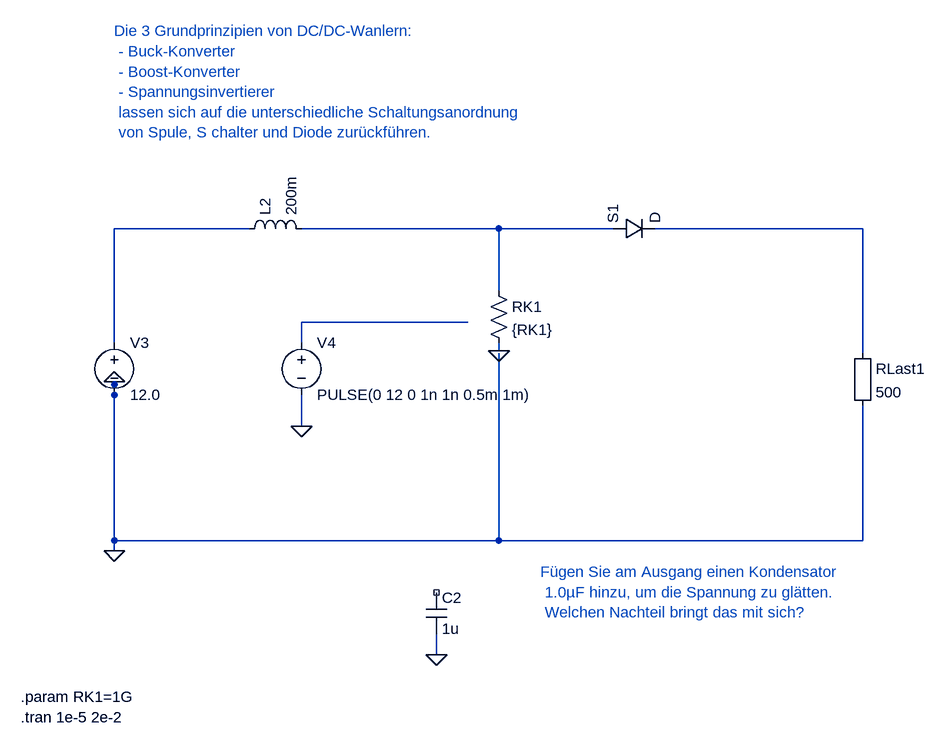
[diagram p0: schematic 2_1_2_Boost_Konverter.asc]
2_1_2_Boost_Konverter.asc, the LTspice schematic file:
Version 4
SHEET 1 880 680
WIRE 208 656 208 640
WIRE 1040 400 1072 400
WIRE 496 656 496 672
WIRE 704 1024 704 1040
WIRE 208 896 208 880
WIRE 208 880 208 640
WIRE 496 576 496 544
WIRE 496 544 752 544
WIRE 496 704 496 672
WIRE 800 496 800 400
WIRE 416 400 208 400
WIRE 208 400 208 576
WIRE 800 400 496 400
WIRE 976 400 800 400
WIRE 800 880 208 880
WIRE 800 592 800 880
WIRE 1072 400 1360 400
WIRE 1360 400 1360 592
WIRE 1360 672 1360 880
WIRE 1360 880 800 880
WIRE 704 1040 704 1056
WIRE 208 656 208 636
WIRE 800 576 800 588
FLAG 208 896 0
FLAG 496 704 0
FLAG 704 1056 0
FLAG 208 636 0
FLAG 496 704 0
FLAG 704 1056 0
FLAG 800 588 0
SYMBOL voltage 208 560 R0
SYMATTR InstName V3
SYMATTR Value 12.0
SYMBOL res 784 480 R0
SYMATTR InstName RK1
SYMATTR Value {RK1}
SYMBOL ind 400 416 R270
SYMATTR InstName L2
SYMATTR Value 200m
SYMBOL diode 976 416 R270
SYMATTR InstName S1
SYMATTR Value D
SYMBOL Misc\EuropeanResistor 1344 576 R0
SYMATTR InstName RLast1
SYMATTR Value 500
SYMBOL voltage 496 560 R0
SYMATTR InstName V4
SYMATTR Value PULSE(0 12 0 1n 1n 0.5m 1m)
SYMBOL cap 688 960 R0
SYMATTR InstName C2
SYMATTR Value 1u
TEXT 64 1120 Left 2 !.param RK1=1G
TEXT 64 1152 Left 2 !.tran 1e-5 2e-2
TEXT 208 96 Left 2 ;Die 3 Grundprinzipien von DC/DC-Wanlern: \n - Buck-Konverter \n - Boost-Konverter \n - Spannungsinvertierer \n lassen sich auf die unterschiedliche Schaltungsanordnung \n von Spule, S chalter und Diode zurückführen.
TEXT 864 928 Left 2 ;Fügen Sie am Ausgang einen Kondensator \n 1.0µF hinzu, um die Spannung zu glätten. \n Welchen Nachteil bringt das mit sich?

The netlist it stands for:
* 2_1_2_Boost_Konverter.asc
V3 N004 0 12.0
RK1 N003 0 {RK1}
L2 N004 N003 200m
D§S1 N003 N001 D
RLast1 N001 0 500
V4 N002 0 PULSE(0 12 0 1n 1n 0.5m 1m)
C2 NC_01 0 1u
.model D D
.lib standard.dio
.param RK1=1G
.tran 1e-5 2e-2
* Die 3 Grundprinzipien von DC/DC-Wanlern:
*  - Buck-Konverter
*  - Boost-Konverter
*  - Spannungsinvertierer
*  lassen sich auf die unterschiedliche Schaltungsanordnung
*  von Spule, S chalter und Diode zurückführen.
* Fügen Sie am Ausgang einen Kondensator
*  1.0µF hinzu, um die Spannung zu glätten.
*  Welchen Nachteil bringt das mit sich?
.backanno
.end